# Altium schematic sheet Button_ClockLed.SchDoc
size A4; SheetNumber: 4; SheetTotal: 8
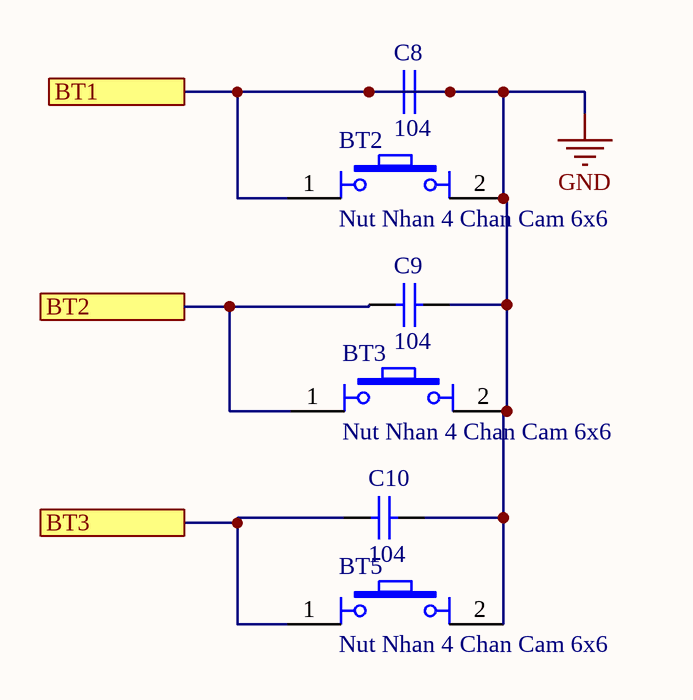
[diagram p0: Button_ClockLed.SchDoc]

## Parts
BT2  Nut Nhan 4 Chan Cam 6x6  [Nut Nhan 4 Chan Cam 6x6]
BT3  Nut Nhan 4 Chan Cam 6x6  [Nut Nhan 4 Chan Cam 6x6]
BT5  Nut Nhan 4 Chan Cam 6x6  [Nut Nhan 4 Chan Cam 6x6]
C8  104  [tu 0805]
C9  104  [tu 0805]
C10  104  [tu 0805]

## Ports
BT1, BT2, BT3

## Nets
GND: BT2.1 BT2.2 BT3.2 BT5.2 C8.1 C8.2 C9.2 C10.1 ; port BT1
BT2: BT3.1 C9.1 ; port BT2
BT3: BT5.1 C10.2 ; port BT3

## Library data of the parts
BT2 BT3 BT5 = Nut Nhan 4 Chan Cam 6x6: Nut Nhan 4 Chan 6x6mm; Ten: Nút Nhấn 4 Chân 6x6x5MM DIP; Ma_Hang: MH004584
C8-C10 = Tu 0805 104 50V 10%: Dán; Don_Vi: Con; So_Chan: 2; Ten_Linh_Kien: Tụ 0805 104-100nF 10% 50V; Ma_Hang: MH004551; Chung_Loai: Dán; Kieu_Chan: *